# Altium project bdcmc-24-2-motors.PrjPcb
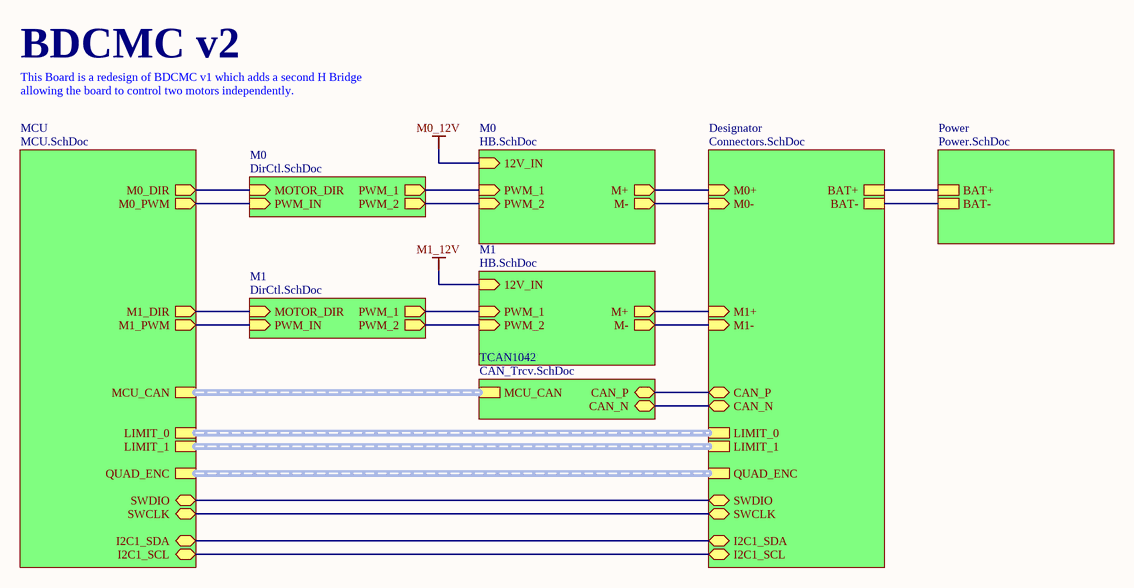
[diagram p0: TLD.SchDoc]
8 sheets, 198 parts. Net scope: hierarchical (ports join the sheet entries above them; power ports are global).
Board file: BDCMC_V2.PcbDoc
Sheets:
  TLD.SchDoc
    Designator = Connectors.SchDoc
    M0 = DirCtl.SchDoc
    M1 = DirCtl.SchDoc
    M0 = HB.SchDoc
    M1 = HB.SchDoc
    Power = Power.SchDoc
      M0 = Buck.SchDoc
      M1 = Buck.SchDoc
    TCAN1042 = CAN_Trcv.SchDoc
    MCU = MCU.SchDoc

## Sheet TLD.SchDoc
size Letter; SheetNumber: 1; SheetTotal: 8

### Sub-sheets
Designator = Connectors.SchDoc: M0+ (in), M0- (in), I2C1_SCL (bidir), M1+ (in), M1- (in), LIMIT_0 (harness LIMIT_0), LIMIT_1 (harness LIMIT_1), CAN_P (bidir), CAN_N (bidir), BAT-, BAT+, QUAD_ENC (harness QUAD_ENC), SWDIO (bidir), SWCLK (bidir), I2C1_SDA (bidir)
M0 = DirCtl.SchDoc: PWM_1 (out), PWM_2 (out), MOTOR_DIR (in), PWM_IN (in)
M0 = HB.SchDoc: M+ (out), M- (out), PWM_1 (in), PWM_2 (in), 12V_IN (in)
M1 = DirCtl.SchDoc: PWM_1 (out), PWM_2 (out), MOTOR_DIR (in), PWM_IN (in)
M1 = HB.SchDoc: M+ (out), M- (out), PWM_1 (in), PWM_2 (in), 12V_IN (in)
MCU = MCU.SchDoc: I2C1_SDA (bidir), I2C1_SCL (bidir), SWCLK (bidir), SWDIO (bidir), LIMIT_0 (harness LIMIT_0), LIMIT_1 (harness LIMIT_1), MCU_CAN (harness MCU_CAN), M1_PWM (out), M1_DIR (out), M0_PWM (out), M0_DIR (out), QUAD_ENC (harness QUAD_ENC)
Power = Power.SchDoc: BAT+, BAT-
TCAN1042 = CAN_Trcv.SchDoc: MCU_CAN (harness MCU_CAN), CAN_P (bidir), CAN_N (bidir)

### Nets
M0_12V: sheet M0/12V_IN, sheet M1/12V_IN  [also labelled M1_12V]  [project net BIAS]
Vin: sheet Designator/BAT+, sheet Power/BAT+
`: sheet M0/MOTOR_DIR, sheet MCU/M0_DIR
`: sheet M1/MOTOR_DIR, sheet MCU/M1_DIR  [a separate net that carries the same name]
CAN_N: sheet Designator/CAN_N, sheet TCAN1042/CAN_N
CAN_P: sheet Designator/CAN_P, sheet TCAN1042/CAN_P
DIR_1_In: sheet M0/PWM_1, sheet M0/PWM_1
DIR_1_In: sheet M1/PWM_1, sheet M1/PWM_1  [a separate net that carries the same name]
DIR_2_In: sheet M0/PWM_2, sheet M0/PWM_2
DIR_2_In: sheet M1/PWM_2, sheet M1/PWM_2  [a separate net that carries the same name]
I2C1_SCL: sheet Designator/I2C1_SCL, sheet MCU/I2C1_SCL
I2C1_SDA: sheet Designator/I2C1_SDA, sheet MCU/I2C1_SDA
M0_PWM: sheet M0/PWM_IN, sheet MCU/M0_PWM
M1_PWM: sheet M1/PWM_IN, sheet MCU/M1_PWM
M+: sheet Designator/M0+, sheet M0/M+
M+: sheet Designator/M1+, sheet M1/M+  [a separate net that carries the same name]
M-: sheet Designator/M0-, sheet M0/M-
M-: sheet Designator/M1-, sheet M1/M-  [a separate net that carries the same name]
SWCLK: sheet Designator/SWCLK, sheet MCU/SWCLK
SWDIO: sheet Designator/SWDIO, sheet MCU/SWDIO
NetQ200_2: sheet Designator/BAT-, sheet Power/BAT-

### Buses and harness runs
harness sheet Designator/LIMIT_0 = sheet MCU/LIMIT_0
harness sheet Designator/LIMIT_1 = sheet MCU/LIMIT_1
harness sheet Designator/QUAD_ENC = sheet MCU/QUAD_ENC
harness sheet MCU/MCU_CAN = sheet TCAN1042/MCU_CAN

### Notes on the sheet
- BDCMC v2
- This Board is a redesign of BDCMC v1 which adds a second H Bridge allowing the board to control two motors independently.

## Sheet Connectors.SchDoc
size Letter; SheetNumber: 2; SheetTotal: 8
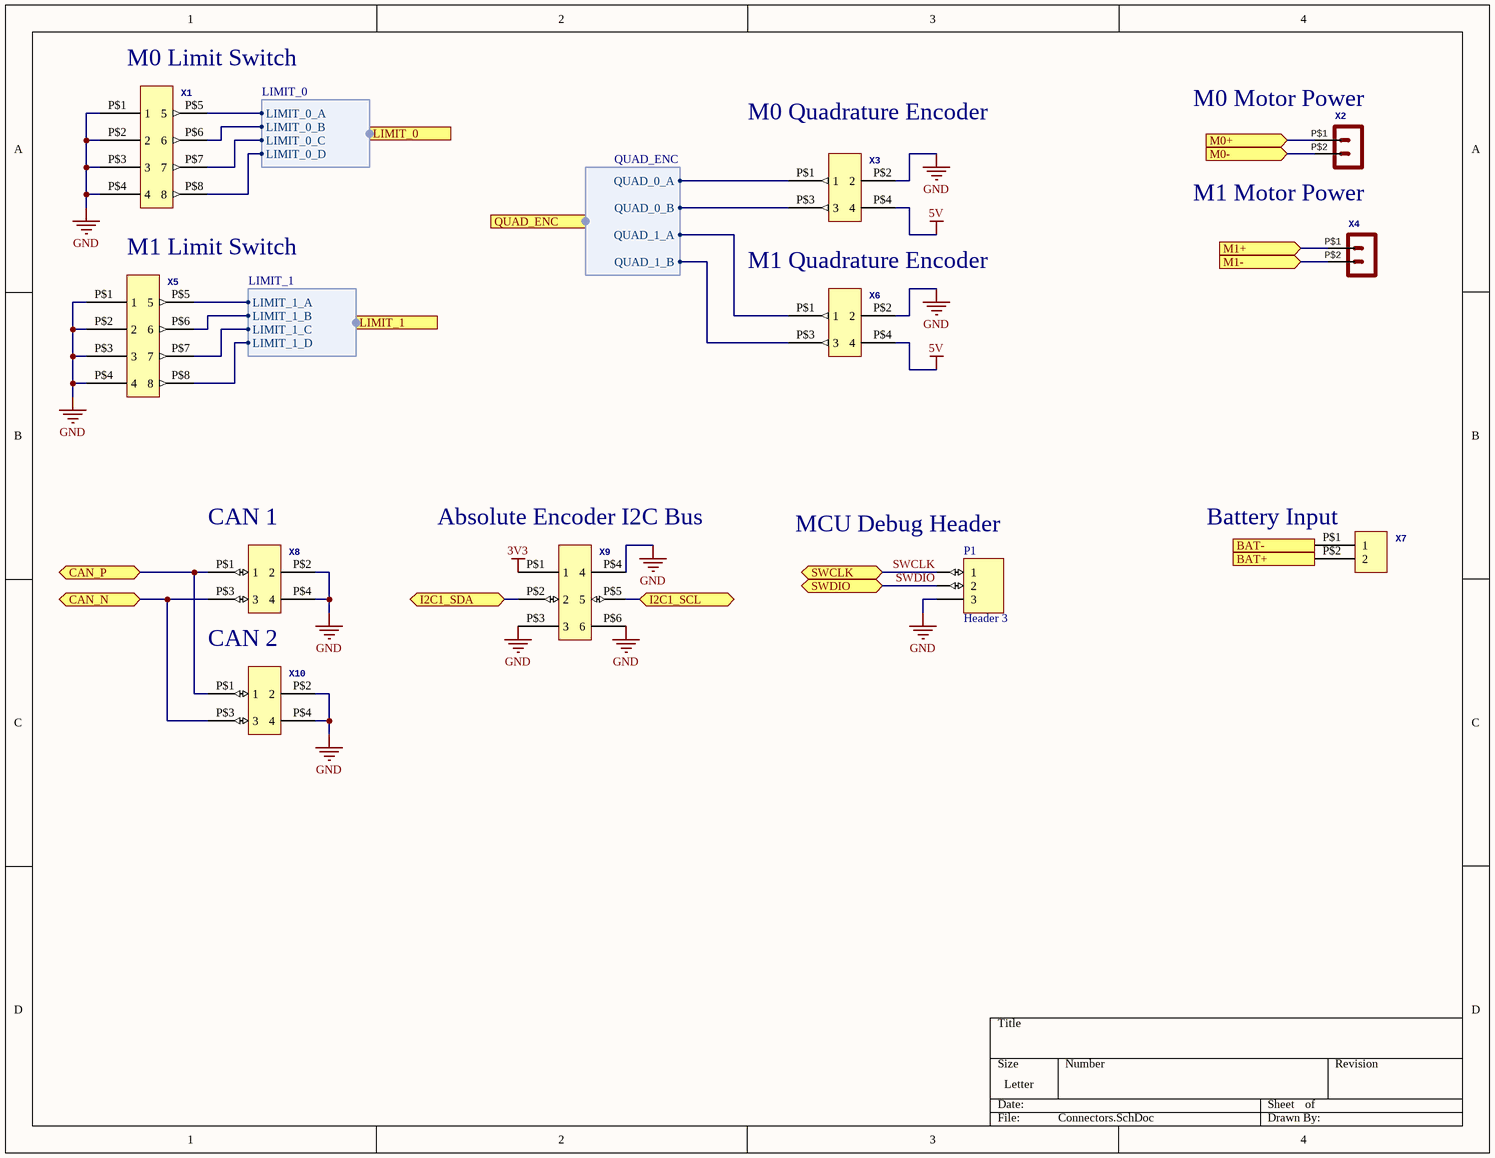
[diagram p1: Connectors.SchDoc]

### Parts
P1  Header 3  [HDR1X3]
X1  Molex 43045-0812  [43045-0812]  (value not drawn)
X2  Molex - Micro-Fit 3.0 Series connector,  3.00mm (0.118") pitch header, 2 positions.  [43045-0212]  (value not drawn)
X3  Molex 43045-0412  [43045-0412]  (value not drawn)
X4  Molex - Micro-Fit 3.0 Series connector,  3.00mm (0.118") pitch header, 2 positions.  [43045-0212]  (value not drawn)
X5  Molex 43045-0812  [43045-0812]  (value not drawn)
X6  Molex 43045-0412  [43045-0412]  (value not drawn)
X7  Molex 43650-0215  [43650-0215]  (value not drawn)
X8  Molex 43045-0412  [43045-0412]  (value not drawn)
X9  Molex 43045-0612  [43045-0612]  (value not drawn)
X10  Molex 43045-0412  [43045-0412]  (value not drawn)

### Ports
BAT+, BAT-, CAN_N (bidir), CAN_P (bidir), I2C1_SCL (bidir), I2C1_SDA (bidir), LIMIT_0 (harness LIMIT_0), LIMIT_1 (harness LIMIT_1), M0+ (in), M0- (in), M1+ (in), M1- (in), QUAD_ENC (harness QUAD_ENC), SWCLK (bidir), SWDIO (bidir)

### Harnesses
LIMIT_0: LIMIT_0_A, LIMIT_0_B, LIMIT_0_C, LIMIT_0_D
LIMIT_1: LIMIT_1_A, LIMIT_1_B, LIMIT_1_C, LIMIT_1_D
QUAD_ENC: QUAD_0_A, QUAD_1_A, QUAD_1_B, QUAD_0_B

### Nets
3V3: X9.P$1(1)  [project net MCU_VBAT]
5V: X3.P$4(4) X6.P$4(4)  [project net CAN_VCC]
GND: P1.3 X1.P$1(1) X1.P$2(2) X1.P$3(3) X1.P$4(4) X3.P$2(2) X5.P$1(1) X5.P$2(2) X5.P$3(3) X5.P$4(4) X6.P$2(2) X8.P$2(2) X8.P$4(4) X9.P$3(3) X9.P$4(4) X9.P$6(6) X10.P$2(2) X10.P$4(4)  [project net MCU_VSS]
Vin: X7.P$2(2) ; port BAT+
CAN_N: X8.P$3(3) X10.P$3(3) ; port CAN_N
CAN_P: X8.P$1(1) X10.P$1(1) ; port CAN_P
I2C1_SCL: X9.P$5(5) ; port I2C1_SCL
I2C1_SDA: X9.P$2(2) ; port I2C1_SDA
M+: X2.P$1 ; port M0+
M+: X4.P$1 ; port M1+  [a separate net that carries the same name]
M-: X2.P$2 ; port M0-
M-: X4.P$2 ; port M1-  [a separate net that carries the same name]
QUAD_0_A: X3.P$1(1) ; port QUAD_ENC.QUAD_0_A
QUAD_0_B: X3.P$3(3) ; port QUAD_ENC.QUAD_0_B
QUAD_1_A: X6.P$1(1) ; port QUAD_ENC.QUAD_1_A
QUAD_1_B: X6.P$3(3) ; port QUAD_ENC.QUAD_1_B
SWCLK: P1.1 ; port SWCLK
SWDIO: P1.2 ; port SWDIO
NetQ200_2: X7.P$1(1) ; port BAT-
NetU100_2: X1.P$5(5) ; port LIMIT_0.LIMIT_0_A
NetU100_3: X1.P$6(6) ; port LIMIT_0.LIMIT_0_B
NetU100_4: X1.P$7(7) ; port LIMIT_0.LIMIT_0_C
NetU100_5: X1.P$8(8) ; port LIMIT_0.LIMIT_0_D
NetU100_15: X5.P$5(5) ; port LIMIT_1.LIMIT_1_A
NetU100_16: X5.P$6(6) ; port LIMIT_1.LIMIT_1_B
NetU100_17: X5.P$7(7) ; port LIMIT_1.LIMIT_1_C
NetU100_18: X5.P$8(8) ; port LIMIT_1.LIMIT_1_D

### Notes on the sheet
- (near X1) M0 Limit Switch
- M0 Quadrature Encoder
- (near X2) M0 Motor Power
- M1 Motor Power
- M1 Limit Switch
- M1 Quadrature Encoder
- (near X8) CAN 1
- (near X9) Absolute Encoder I2C Bus
- (near P1) MCU Debug Header
- (near X7) Battery Input
- CAN 2

### Library data of the parts
P1 = Header 3: Header, 3-Pin; LatestRevisionDate: 17-Jul-2002; LatestRevisionNote: Re-released for DXP Platform.; Publisher: Altium Limited
X1 X5 = Micro-Fit Molex 8 Pin 2 Row Vertical: GateName_1: G$1; SymbolName_1: HEADER_POS8; DeviceSetName: HEADER_POS8_?; DeviceName: 43045-0812; LibraryName: con-molex-micro-fit-3_0_2; Package: 43045-0812
X2 X4 = HEADER_POS2_?43045-0212: GateName_1: G$1; SymbolName_1: HEADER_POS2; DeviceName: 43045-0212; LibraryName: con-molex-micro-fit-3_0_2; DeviceSetName: HEADER_POS2_?; Package: 43045-0212
X3 X6 X8 X10 = Micro-Fit Molex 4 Pin 2 Row Vertical: GateName_1: G$1; SymbolName_1: HEADER_POS4; DeviceSetName: HEADER_POS4_?; DeviceName: 43045-0412; LibraryName: con-molex-micro-fit-3_0_2; Package: 43045-0412
X7 = Micro-Fit Molex 2 Pin Vertical: SymbolName_1: HEADER_POS2; DeviceSetName: HEADER_POS2_?; GateName_1: G$1; Package: 43650-0215; DeviceName: 43650-0215; LibraryName: con-molex-micro-fit-3_0_2
X9 = Micro-Fit Molex 6 Pin 2 Row Vertical: GateName_1: G$1; SymbolName_1: HEADER_POS6; DeviceSetName: HEADER_POS6_?; DeviceName: 43045-0612; LibraryName: con-molex-micro-fit-3_0_2; Package: 43045-0612

## Sheet DirCtl.SchDoc
size Letter; SheetNumber: 3; SheetTotal: 8
Used 2 times, as channels M0, M1. Parts and nets are listed once, with the designators drawn on the sheet.
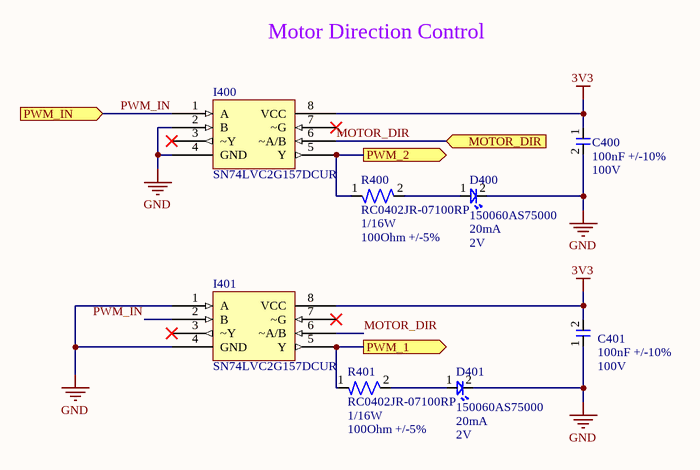
[diagram p2: DirCtl.SchDoc]

### Parts
C400  Capacitance: 100nF +/-10%  Voltage Rating: 100V  [CAP-0603]  (hidden comment: CC0603KRX7R0BB104)
C401  Capacitance: 100nF +/-10%  Voltage Rating: 100V  [CAP-0603]  (hidden comment: CC0603KRX7R0BB104)
D400  150060AS75000  Current Rating: 20mA  Vf: 2V  [LED-0603]
D401  150060AS75000  Current Rating: 20mA  Vf: 2V  [LED-0603]
I400  SN74LVC2G157DCUR  [IC-MUX-8VSSOP]
I401  SN74LVC2G157DCUR  [IC-MUX-8VSSOP]
R400  RC0402JR-07100RP  Power Rating: 1/16W  Resistance: 100Ohm +/-5%  [RES-0402]
R401  RC0402JR-07100RP  Power Rating: 1/16W  Resistance: 100Ohm +/-5%  [RES-0402]

### Ports
MOTOR_DIR (in), PWM_1 (out), PWM_2 (out), PWM_IN (in)

### Nets
3V3: C400.1 C401.2 I400.8(VCC) I401.8(VCC)
GND: C400.2 C401.1 D400.2 D401.2 I400.2(B) I400.4(GND) I401.1(A) I401.4(GND)
`: I400.6(~A/B) I401.6(~A/B) ; port MOTOR_DIR  [also labelled MOTOR_DIR]
PWM_1: I401.5(Y) R401.1 ; port PWM_1
PWM_2: I400.5(Y) R400.1 ; port PWM_2
PWM_IN: I400.1(A) I401.2(B) ; port PWM_IN
NetD400_1: D400.1 R400.2
NetD401_1: D401.1 R401.2

Not connected (* = marked no-connect by the designer): I400 3(~Y)* 7(~G)*; I401 3(~Y)* 7(~G)*

### Channels
M0: designators end in _M0; ports MOTOR_DIR=` PWM_1=DIR_1_In PWM_2=DIR_2_In PWM_IN=M0_PWM
M1: designators end in _M1; ports MOTOR_DIR=` PWM_1=DIR_1_In PWM_2=DIR_2_In PWM_IN=M1_PWM

### Notes on the sheet
- Motor Direction Control

### Library data of the parts
C400 C401 = CAP-100N-0001: CAP CER 0.1UF 100V X7R 0603; Manufacturer: YAGEO; Assembled?: no; Manufacturer Part Number: CC0603KRX7R0BB104; Temperature Coefficient: X7R; Package Size: 0603
D400 D401 = LED_Amber_0001: CAP CER 0.1UF 100V X7R 0603; Manufacturer: Wurth Electronik; Assembled?: no; Color: Amber; Manufacturer Part Number: 150060AS75000; Package Size: 0603
I400 = IC-MUX-0001
I401 = IC-MUX-0001: Multiplexer 1 x 2:1 8-VSSOP; Vin: 1.65-5.5V
R400 R401 = RES-100-0001: RES SMD 100 OHM 5% 1/16W 0402; Manufacturer: YAGEO; Assembled?: no; Manufacturer Part Number: RC0402JR-07100RP; Package Size: 0402

## Sheet HB.SchDoc
size Letter; SheetNumber: 6; SheetTotal: 8
Used 2 times, as channels M0, M1. Parts and nets are listed once, with the designators drawn on the sheet.
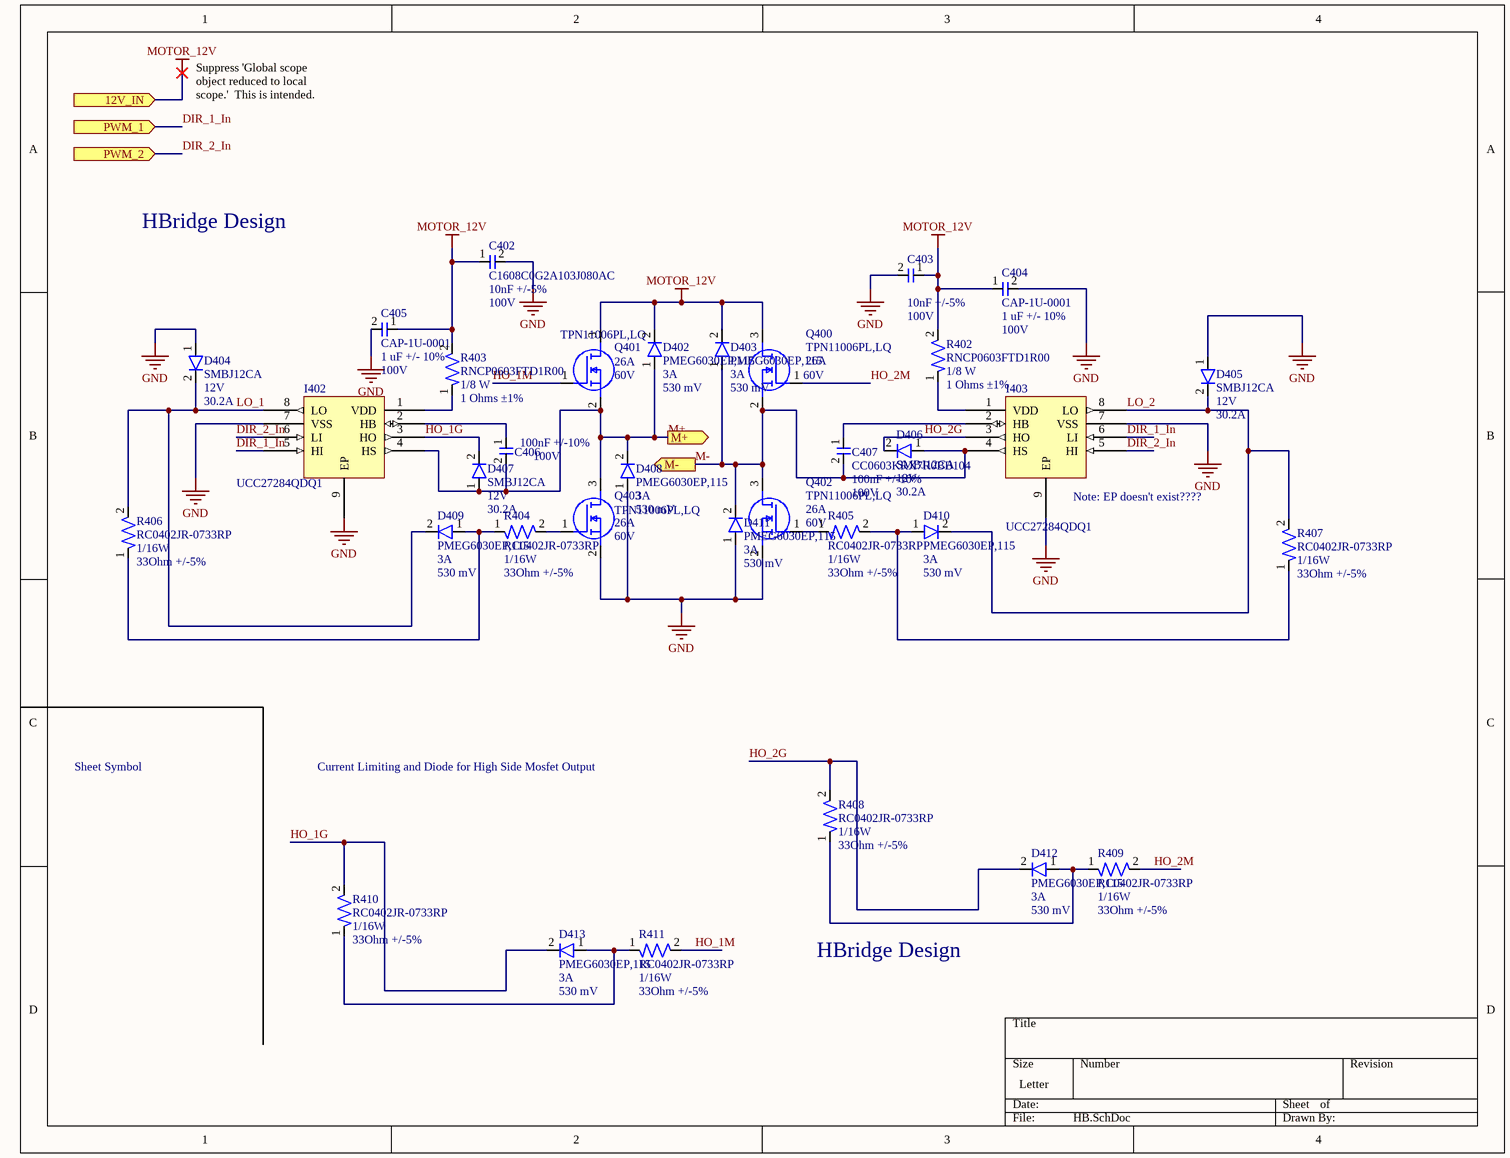
[diagram p3: HB.SchDoc]

### Parts
C402  C1608C0G2A103J080AC  Capacitance: 10nF +/-5%  Voltage Rating: 100V  [CAP-0603]
C403  Capacitance: 10nF +/-5%  Voltage Rating: 100V  [CAP-0603]  (hidden comment: C1608C0G2A103J080AC)
C404  CAP-1U-0001  Capacitance: 1 uF +/- 10%  Voltage: 100V  [CAP-1206 - duplicate]
C405  CAP-1U-0001  Capacitance: 1 uF +/- 10%  Voltage: 100V  [CAP-1206]
C406  Capacitance: 100nF +/-10%  Voltage Rating: 100V  [CAP-0603]  (hidden comment: CC0603KRX7R0BB104)
C407  CC0603KRX7R0BB104  Capacitance: 100nF +/-10%  Voltage Rating: 100V  [CAP-0603]
D402  PMEG6030EP,115  Current Rating: 3A  Vf (Voltage Forward): 530 mV  [DIO-SOD128]
D403  PMEG6030EP,115  Current Rating: 3A  Vf (Voltage Forward): 530 mV  [DIO-SOD128]
D404  SMBJ12CA  Standoff Voltage: 12V  Current Rating: 30.2A  [DO-214AA (SMBJ)]
D405  SMBJ12CA  Standoff Voltage: 12V  Current Rating: 30.2A  [DO-214AA (SMBJ)]
D406  SMBJ12CA  Standoff Voltage: 12V  Current Rating: 30.2A  [DO-214AA (SMBJ)]
D407  SMBJ12CA  Standoff Voltage: 12V  Current Rating: 30.2A  [DO-214AA (SMBJ)]
D408  PMEG6030EP,115  Current Rating: 3A  Vf (Voltage Forward): 530 mV  [DIO-SOD128]
D409  PMEG6030EP,115  Current Rating: 3A  Vf (Voltage Forward): 530 mV  [DIO-SOD128]
D410  PMEG6030EP,115  Current Rating: 3A  Vf (Voltage Forward): 530 mV  [DIO-SOD128]
D411  PMEG6030EP,115  Current Rating: 3A  Vf (Voltage Forward): 530 mV  [DIO-SOD128]
D412  PMEG6030EP,115  Current Rating: 3A  Vf (Voltage Forward): 530 mV  [DIO-SOD128]
D413  PMEG6030EP,115  Current Rating: 3A  Vf (Voltage Forward): 530 mV  [DIO-SOD128]
I402  UCC27284QDQ1  [IC-BUCK-8SOIC]
I403  UCC27284QDQ1  [IC-BUCK-8SOIC]
Q400  TPN11006PL,LQ  Id-Continuous: 26A  VDS-Max: 60V  [NMOS-8TSON]
Q401  TPN11006PL,LQ  Id-Continuous: 26A  VDS-Max: 60V  [NMOS-8TSON]
Q402  TPN11006PL,LQ  Id-Continuous: 26A  VDS-Max: 60V  [NMOS-8TSON]
Q403  TPN11006PL,LQ  Id-Continuous: 26A  VDS-Max: 60V  [NMOS-8TSON]
R402  RNCP0603FTD1R00  Power: 1/8 W  Resistance: 1 Ohms ±1%  [RES-0603]
R403  RNCP0603FTD1R00  Power: 1/8 W  Resistance: 1 Ohms ±1%  [RES-0603]
R404  RC0402JR-0733RP  Power Rating: 1/16W  Resistance: 33Ohm +/-5%  [RES-0402]
R405  RC0402JR-0733RP  Power Rating: 1/16W  Resistance: 33Ohm +/-5%  [RES-0402]
R406  RC0402JR-0733RP  Power Rating: 1/16W  Resistance: 33Ohm +/-5%  [RES-0402]
R407  RC0402JR-0733RP  Power Rating: 1/16W  Resistance: 33Ohm +/-5%  [RES-0402]
R408  RC0402JR-0733RP  Power Rating: 1/16W  Resistance: 33Ohm +/-5%  [RES-0402]
R409  RC0402JR-0733RP  Power Rating: 1/16W  Resistance: 33Ohm +/-5%  [RES-0402]
R410  RC0402JR-0733RP  Power Rating: 1/16W  Resistance: 33Ohm +/-5%  [RES-0402]
R411  RC0402JR-0733RP  Power Rating: 1/16W  Resistance: 33Ohm +/-5%  [RES-0402]

### Ports
12V_IN (in), M+ (out), M- (out), PWM_1 (in), PWM_2 (in)

### Nets
GND: C402.2 C403.2 C404.2 C405.2 D404.1 D405.1 D408.1 D411.1 I402.7(VSS) I402.9(EP) I403.7(VSS) I403.9(EP) Q402.2(S) Q403.2(S)
MOTOR_12V: C402.1 C403.1 C404.1 C405.1 D402.2 D403.2 Q400.3(D) Q401.3(D) R402.2 R403.2 ; port 12V_IN
DIR_1_In: I402.5(HI) I403.6(LI) ; port PWM_1
DIR_2_In: I402.6(LI) I403.5(HI) ; port PWM_2
HO_1G: D407.2 D413.2 I402.3(HO) R410.2
HO_1M: Q401.1(G) R411.2
HO_2G: D406.2 D412.2 I403.3(HO) R408.2
HO_2M: Q400.1(G) R409.2
LO_1: D404.2 D409.2 I402.8(LO) R406.2
LO_2: D405.2 D410.2 I403.8(LO) R407.2
M+: C406.2 D402.1 D407.1 D408.2 I402.4(HS) Q401.2(S) Q403.3(D) ; port M+
M-: C407.2 D403.1 D406.1 D411.2 I403.4(HS) Q400.2(S) Q402.3(D) ; port M-
NetC406_1: C406.1 I402.2(HB)
NetC407_1: C407.1 I403.2(HB)
NetD409_1: D409.1 R404.1 R406.1
NetD410_1: D410.1 R405.2 R407.1
NetD412_1: D412.1 R408.1 R409.1
NetD413_1: D413.1 R410.1 R411.1
NetI402_1: I402.1(VDD) R403.1
NetI403_1: I403.1(VDD) R402.1
NetQ402_1: Q402.1(G) R405.1
NetQ403_1: Q403.1(G) R404.2

### Channels
M0: designators end in _M0; ports 12V_IN=BIAS M+=M+ M-=M- PWM_1=DIR_1_In PWM_2=DIR_2_In
M1: designators end in _M1; ports 12V_IN=BIAS M+=M+ M-=M- PWM_1=DIR_1_In PWM_2=DIR_2_In

### Notes on the sheet
- Suppress 'Global scope object reduced to local scope.'  This is intended.
- HBridge Design
- (near I403) Note: EP doesn't exist????
- Sheet Symbol
- Current Limiting and Diode for High Side Mosfet Output

### Library data of the parts
C402 C403 = CAP-10N-0002: CAP CER 10000PF 100V C0G 0603; Manufacturer: TDK Corporation; Temperature Coefficient: C0G/NP0; Assembled?: no; Manufacturer Part Number: C1608C0G2A103J080AC; Package Size: 0603
C404 C405 = CAP-1U-0001: 1 µF ±10% 100V Ceramic Capacitor X7R 1206 (3216 Metric)
C406 C407 = CAP-100N-0001: as C400 on sheet DirCtl; Manufacturer Part Number: CC0603KRX7R0BB104; Temperature Coefficient: X7R; Package Size: 0603
D402 D403 D408-D413 = DIO-0.53V-0001: Diode Schottky 60 V 3A Surface Mount SOD-128/CFP5; Manufacturer: Nexperia USA Inc.; Assembled: no; Manufacturer Part Number: PMEG6030EP,115; Package: SOD-128/CFP5
D404-D407 = DIO-19.9V-0001: 19.9V Clamp 30.2A Ipp Tvs Diode Surface Mount DO-214AA (SMBJ); Manufacturer: Littlefuse Inc.; Assembled: No; Breakdown Voltage: 13.3; Manufacturer Part Number: SMBJ12CA; Package: DO-214AA (SMBJ)
I402 I403 = IC-GDRV-0001: Gate Drivers Automotive 3-A, 120-V half bridge gate driver with 5-V UVLO and enable 8-SOIC -40 to 125; Manufacturer: Texas Instruments; Assembled?: no; VCC-Max: 16V; VCC-Min: 5.5V; Load Voltage-Max: 120V; Supply Current: 3A; Manufacturer Part Number: UCC27284QDQ1; Package: SOIC-8
Q400-Q403 = NMOS-26A-0001: MOSFET N-CH 60V 200MA SOT23; Manufacturer: Toshiba; FET type: N-Channel; Rds On-Max: 18.1mOhm; Vgs-Max: 20V; Assembled?: no; Manufacturer Part Number: TPN11006PL,LQ; Package: 8-TSON Advance
R402 R403 = RES-1-0001: 1 Ohms ±1% 0.125W, 1/8W Chip Resistor 0603 (1608 Metric) Anti-Sulfur Thin Film
R404-R411 = RES-33-0001: RES SMD 33 OHM 5% 1/16W 0402; Manufacturer: YAGEO; Assembled?: no; Manufacturer Part Number: RC0402JR-0733RP; Package Size: 0402

## Sheet Power.SchDoc
size Letter; SheetNumber: 4; SheetTotal: 8
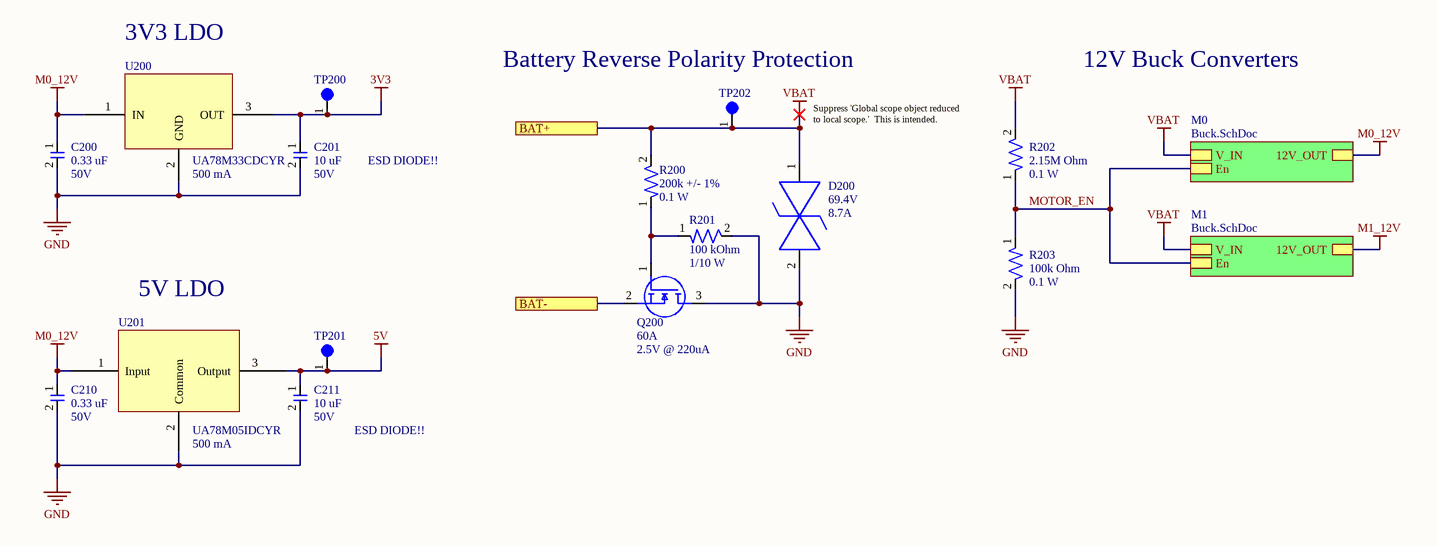
[diagram p4: Power.SchDoc]

### Parts
C200  Capacitance: 0.33 uF  Voltage: 50V  [CAP-0603]  (hidden comment: CGA3E3X7R1H334K080AB)
C201  Capacitance: 10 uF  Voltage Rating: 50V  [CAP-1206]  (hidden comment: CL31B106KBHNNNE)
C210  Capacitance: 0.33 uF  Voltage: 50V  [CAP-0603]  (hidden comment: CGA3E3X7R1H334K080AB)
C211  Capacitance: 10 uF  Voltage Rating: 50V  [CAP-1206]  (hidden comment: CL31B106KBHNNNE)
D200  Vclamp: 69.4V  Peak pulser current: 8.7A  [DO-214AA (SMBJ)]  (hidden comment: SMBJE43CAH)
Q200  Drain Current: 60A  Vgs: 2.5V @ 220uA  [NMOS-8PowerVDFN]  (hidden comment: TPH7R006PL,L1Q)
R200  Resistance: 200k +/- 1%  Power Rating: 0.1 W  [RES-0603]  (hidden comment: ERJ-3EKF2003V)
R201  Resistance: 100 kOhm  Power: 1/10 W  [RES-0603]  (hidden comment: RC0603FR-07100KL)
R202  Resistance: 2.15M Ohm  Power: 0.1 W  [RES-0603]  (hidden comment: RC0603FR-072M15L)
R203  Resistance: 100k Ohm  Power: 0.1 W  [RES-0603]  (hidden comment: RC0603FR-07100KL)
TP200  5003  [TEST-POINT-0001]  (value not drawn)
TP201  5003  [TEST-POINT-0001]  (value not drawn)
TP202  5003  [TEST-POINT-0001]  (value not drawn)
U200  UA78M33CDCYR  Current: 500 mA  [IC-SOT-223-4]
U201  UA78M05IDCYR  Current: 500 mA  [IC-SOT-223-4]

### Sub-sheets
M0 = Buck.SchDoc: En, 12V_OUT, V_IN
M1 = Buck.SchDoc: En, 12V_OUT, V_IN

### Ports
BAT+, BAT-

### Nets
3V3: C201.1 TP200.1 U200.3(OUT)  [project net MCU_VBAT]
5V: C211.1 TP201.1 U201.3(Output)  [project net CAN_VCC]
GND: C200.2 C201.2 C210.2 C211.2 D200.2 Q200.3(D) R201.2 R203.2 U200.2(GND) U201.2(Common)  [project net MCU_VSS]
M0_12V: C200.1 C210.1 U200.1(IN) U201.1(Input) ; sheet M0/12V_OUT, sheet M1/12V_OUT  [also labelled M1_12V]  [project net BIAS]
VBAT: D200.1 R200.2 R202.2 TP202.1 ; port BAT+, sheet M0/V_IN, sheet M1/V_IN  [project net Vin]
MOTOR_EN: R202.1 R203.1 ; sheet M0/En, sheet M1/En
NetQ200_1: Q200.1(G) R200.1 R201.1
NetQ200_2: Q200.2(S) ; port BAT-

### Notes on the sheet
- 3V3 LDO
- (near TP202) Battery Reverse Polarity Protection
- 12V Buck Converters
- Suppress 'Global scope object reduced to local scope.'  This is intended.
- ESD DIODE!!
- 5V LDO

### Library data of the parts
C200 C210 = CAP-0.33uF-0001: 0.33 µF ±10% 50V Ceramic Capacitor X7R 0603 (1608 Metric); Manufacturer: TDK Corporation; Manufacturer Part Number: CGA3E3X7R1H334K080AB; Tolerance: 10%; Temperature Coefficient: X7R
C201 C211 = CAP-10U-0001: 10 µF ±10% 50V Ceramic Capacitor X7R 1206 (3216 Metric); Manufacturer: Samsung Electro-Mechanics; Assembled?: no; Manufacturer Part Number: CL31B106KBHNNNE; Temperature Coefficient: X7R; Tolerance: 10%; Package Size: 1206
D200 = DIO-69.4V-0001: 69.4V Clamp 8.7A Ipp Tvs Diode Surface Mount DO-214AA (SMBJ); Channels: Bidirectional; Breakdown VOltage: 47.8V; Reverse working maximum voltage: 43V; Package: DO-214AA (SMBJ)
Q200 = NMOS-60A-0001: N-Channel 60 V 60A (Tc) 81W (Tc) Surface Mount 8-SOP Advance (5x5); Vdss: 60V; Vgs(Max): 20V; Package: 8-PowerVDFN
R200 = RES-200K-0001: 200 kOhms ±1% 0.1W, 1/10W Chip Resistor 0603 (1608 Metric) Automotive AEC-Q200 Thick Film; Manufacturer: Panasonic Electronic Components; Assembled?: Yes; MFP: ERJ-3EKF2003V; Package SIze: 0603
R201 = RES-100K-0003: 100 kOhms ±1% 0.1W, 1/10W Chip Resistor 0603 (1608 Metric) Moisture Resistant Thick Film; Tolerance: +/- 1%; Assembled?: No; Package Size: 0603
R202 = RES-2.15M-0001: 2.15 MOhms ±1% 0.1W, 1/10W Chip Resistor 0603 (1608 Metric) Moisture Resistant Thick Film; Assembled?: No; Tolerance: 1%; Package Size: 0603
R203 = RES-100K-0003: 100 kOhms ±1% 0.1W, 1/10W Chip Resistor 0603 (1608 Metric) Moisture Resistant Thick Film; Assembled?: No; Tolerance: 1%; Package Size: 0603
TP200-TP202 = TEST-POINT-0001: Oranange PC Test Point, Miniature Phoisphor Bronze Silver Plating Through Hole Mounting Type
U200 = IC-LDO-3.3V-0002: Linear Voltage Regulator IC Positive Fixed 1 Output 500mA SOT-223-4; Vin: 25V; Vout: 3.3V; Package: SOT-223-4
U201 = IC-LDO-5V-0003: Linear Voltage Regulator IC Positive Fixed 1 Output 500mA SOT-223-4; Manufacturer: Texas Instruments; Assembled?: no; Manufacturer Part Number: UA78M05IDCYR; Package Size: SOT223-4; Type: Low dropout (LDO)

## Sheet Buck.SchDoc
size Letter; SheetNumber: 5; SheetTotal: 8
Used 2 times, as channels Power/M0, Power/M1. Parts and nets are listed once, with the designators drawn on the sheet.
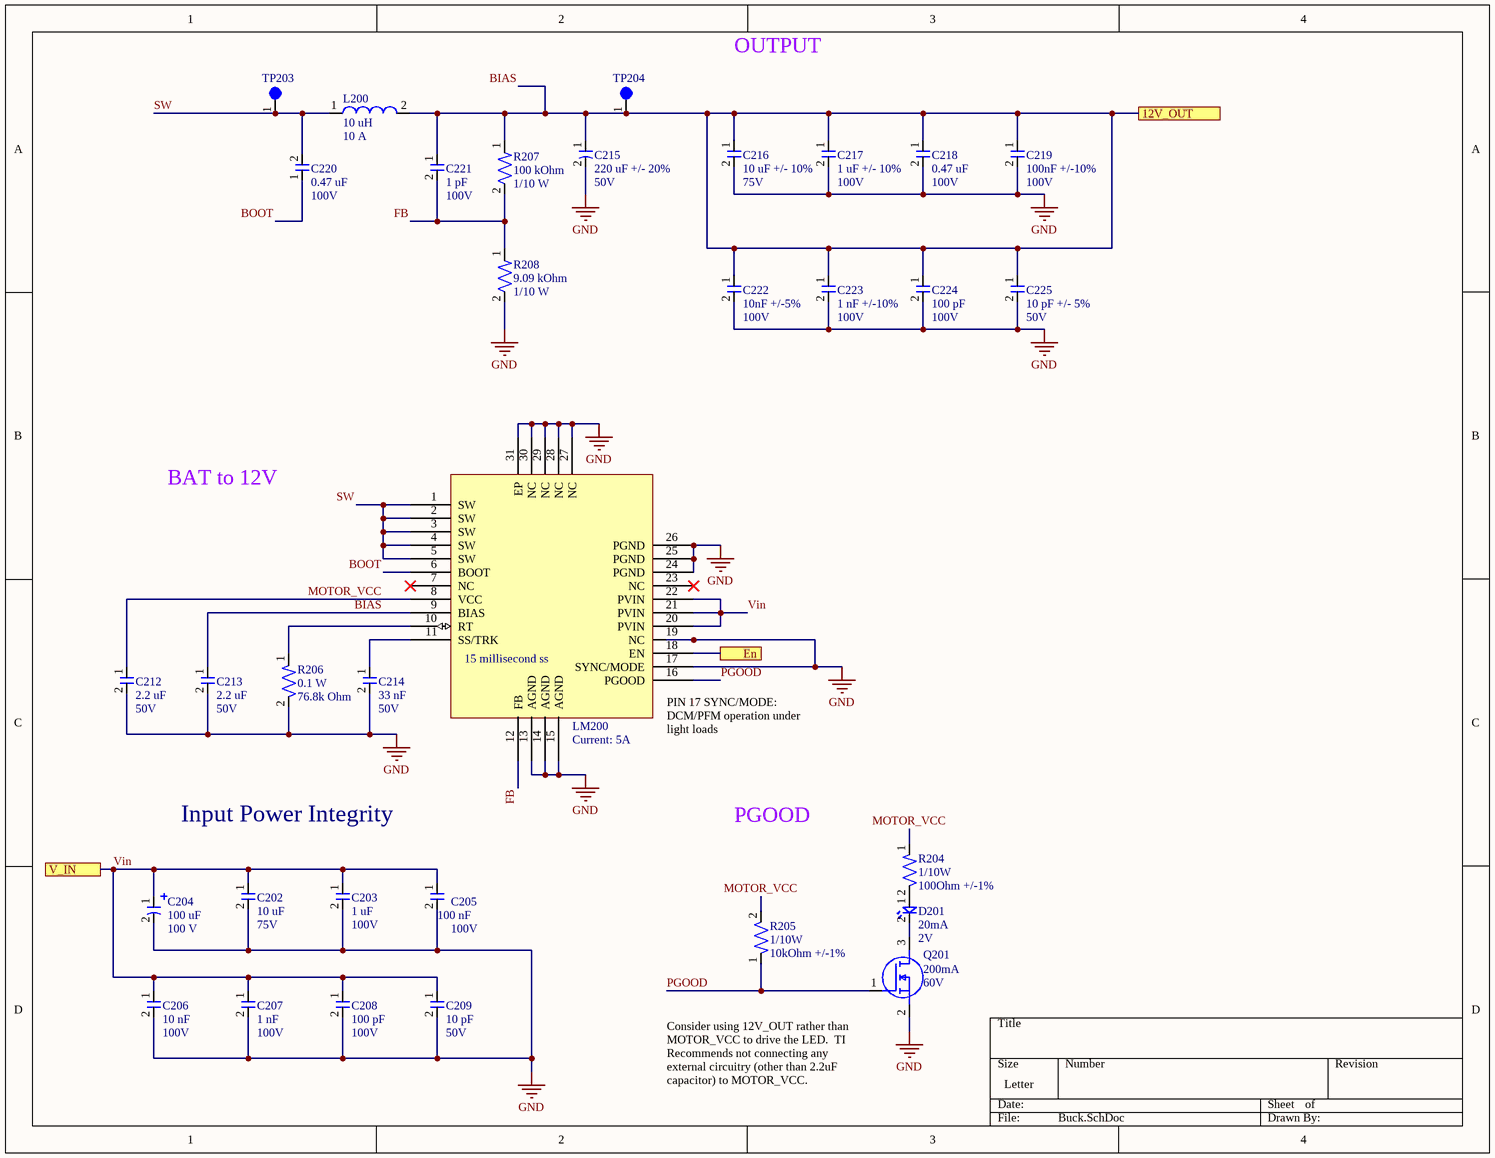
[diagram p5: Buck.SchDoc]

### Parts
C202  Capacitance: 10 uF  Voltage Rating: 75V  [CAP-1210]  (hidden comment: C3225X7R1N106K250AC)
C203  Capacitance: 1 uF  Voltage: 100V  [CAP-1206]  (hidden comment: CL31B105KCHNNNE)
C204  Capacitance: 100 uF  Voltage: 100 V  [ELEC-100U-0001]  (hidden comment: 100SEV100M12.5X16)
C205  Capacitance: 100 nF  Voltage Rating: 100V  [CAP-0603]  (hidden comment: CC0603KRX7R0BB104)
C206  Capacitance: 10 nF  Voltage Rating: 100V  [CAP-0603]  (hidden comment: C1608C0G2A103J080AC)
C207  Capacitance: 1 nF  Voltage: 100V  [CAP-0603]  (hidden comment: C0603Y102K1RAC7867)
C208  Capacitance: 100 pF  Voltage: 100V  [CAP-0603]  (hidden comment: 0603N101J101CT)
C209  Capacitance: 10 pF  Voltage Rating: 50V  [CAP-0603]  (hidden comment: 0603N100J500CT)
C212  Capacitance: 2.2 uF  oltage: 50V  [CAP-0603]  (hidden comment: UMK107BBJ225KA-T)
C213  Capacitance: 2.2 uF  oltage: 50V  [CAP-0603]  (hidden comment: UMK107BBJ225KA-T)
C214  Capacitance: 33 nF  Voltage Rating: 50V  [CAP-0603]  (hidden comment: CC0603KRX7R9BB333)
C215  Capacitance: 220 uF +/- 20%  Voltage Rating: 50V  [ELEC-220U-0003]  (hidden comment: 50TZV220M10X10.5)
C216  Capacitance: 10 uF +/- 10%  Voltage Rating: 75V  [CAP-1210]  (hidden comment: C3225X7R1N106K250AC)
C217  Capacitance: 1 uF +/- 10%  Voltage: 100V  [CAP-1206]  (hidden comment: CL31B105KCHNNNE)
C218  Capacitance: 0.47 uF  Voltage: 100V  [CAP-0805]  (hidden comment: KAM21KR72A474KL)
C219  Capacitance: 100nF +/-10%  Voltage Rating: 100V  [CAP-0603]  (hidden comment: CC0603KRX7R0BB104)
C220  Capacitance: 0.47 uF  Voltage: 100V  [CAP-0805]  (hidden comment: KAM21KR72A474KL)
C221  Capacitance: 1 pF  Voltage: 100V  [CAP-0603]  (hidden comment: 885012006087)
C222  Capacitance: 10nF +/-5%  Voltage Rating: 100V  [CAP-0603]  (hidden comment: C1608C0G2A103J080AC)
C223  Capacitance: 1 nF +/-10%  Voltage: 100V  [CAP-0603]  (hidden comment: C0603Y102K1RAC7867)
C224  Capacitance: 100 pF  Voltage: 100V  [CAP-0603]  (hidden comment: 0603N101J101CT)
C225  Capacitance: 10 pF +/- 5%  Voltage Rating: 50V  [CAP-0603]  (hidden comment: 0603N100J500CT)
D201  Current Rating: 20mA  Vf: 2V  [LED-0603]  (hidden comment: 150060AS75000)
L200  Inductance: 10 uH  DCI: 10 A  [PWRIND-10U-0002]  (hidden comment: SRP1270-100M)
LM200  Current: 5A  [IC-30-WQFN(6x4)]  (hidden comment: LM76005RNPR)
Q201  Id-Continuous: 200mA  VDS-Max: 60V  [NMOS-SOT23-3]  (hidden comment: T2N7002AK,LM)
R204  Power Rating: 1/10W  Resistance: 100Ohm +/-1%  [RES-0603]  (hidden comment: AC0603FR-10100RL)
R205  Power Rating: 1/10W  Resistance: 10kOhm +/-1%  [RES-0603]  (hidden comment: RC0603FR-0710KP)
R206  Power: 0.1 W  Resistance: 76.8k Ohm  [RES-0603]  (hidden comment: RC0603FR-0776K8L)
R207  Resistance: 100 kOhm  Power: 1/10 W  [RES-0603]  (hidden comment: RC0603FR-07100KL)
R208  Resistance: 9.09 kOhm  Power: 1/10 W  [RES-0603]  (hidden comment: RC0603FR-079K09L)
TP203  5003  [TEST-POINT-0001]  (value not drawn)
TP204  5003  [TEST-POINT-0001]  (value not drawn)

### Ports
12V_OUT, En, V_IN

### Nets
GND: C202.2 C203.2 C204.2 C205.2 C206.2 C207.2 C208.2 C209.2 C212.2 C213.2 C214.2 C215.2 C216.2 C217.2 C218.2 C219.2 C222.2 C223.2 C224.2 C225.2 LM200.13(AGND) LM200.14(AGND) LM200.15(AGND) LM200.17(SYNC/MODE) LM200.19(NC) LM200.24(PGND) LM200.25(PGND) LM200.26(PGND) LM200.27(NC) LM200.28(NC) LM200.29(NC) LM200.30(NC) LM200.31(EP) Q201.2(S) R206.2 R208.2
BIAS: C213.1 C215.1 C216.1 C217.1 C218.1 C219.1 C221.1 C222.1 C223.1 C224.1 C225.1 L200.2 LM200.9(BIAS) R207.1 TP204.1 ; port 12V_OUT
BOOT: C220.1 LM200.6(BOOT)
En: LM200.18(EN) ; port En
FB: C221.2 LM200.12(FB) R207.2 R208.1
MOTOR_VCC: C212.1 LM200.8(VCC) R204.1 R205.2
PGOOD: LM200.16(PGOOD) Q201.1(G) R205.1
SW: C220.2 L200.1 LM200.1(SW) LM200.2(SW) LM200.3(SW) LM200.4(SW) LM200.5(SW) TP203.1
Vin: C202.1 C203.1 C204.1 C205.1 C206.1 C207.1 C208.1 C209.1 LM200.20(PVIN) LM200.21(PVIN) LM200.22(PVIN) ; port V_IN
NetC214_1: C214.1 LM200.11(SS/TRK)
NetD201_1: D201.1 R204.2
NetD201_2: D201.2 Q201.3(D)
NetLM200_10: LM200.10(RT) R206.1

Not connected (* = marked no-connect by the designer): LM200 7(NC)* 23(NC)*

### Channels
Power/M0: designators end in _M0; ports 12V_OUT=BIAS En=MOTOR_EN V_IN=Vin
Power/M1: designators end in _M1; ports 12V_OUT=BIAS En=MOTOR_EN V_IN=Vin

### Notes on the sheet
- OUTPUT
- BAT to 12V
- (near LM200) 15 millisecond ss
- (near LM200) PIN 17 SYNC/MODE: DCM/PFM operation under light loads
- Input Power Integrity
- PGOOD
- (near Q201) Consider using 12V_OUT rather than MOTOR_VCC to drive the LED.  TI Recommends not connecting any external circuitry (other than 2.2uF capacitor) to MOTOR_VCC.

### Library data of the parts
C202 C216 = CAP-10U-0004: 10 µF ±10% 75V Ceramic Capacitor X7R 1210 (3225 Metric)
  C202: Tolerance: 10%
C203 C217 = CAP-1U-0001: as C404 on sheet HB
  C203: Tolerance: 10%
C204 = ELEC-100U-0001: 100 µF 100 V Aluminum Electrolytic Capacitors Radial, Can - SMD 2000 Hrs @ 85°C; Manufacturer: Rubycon; Tolerance: 20%; Assembled?: No; ESR: idk check the datasheet i couldnt find it
C205 = CAP-100N-0001: CAP CER 0.1UF 100V X7R 0603; Manufacturer: YAGEO; Assembled?: no; Tolerance: 10%; Manufacturer Part Number: CC0603KRX7R0BB104; Temperature Coefficient: X7R; Package Size: 0603
C206 = CAP-10N-0002: CAP CER 10000PF 100V C0G 0603; Manufacturer: TDK Corporation; Temperature Coefficient: C0G/NP0; Assembled?: no; Tolerance: 5%; Manufacturer Part Number: C1608C0G2A103J080AC; Package Size: 0603
C207 C223 = CAP-1N-0001: 1000 pF ±10% 100V Ceramic Capacitor X7R 0603 (1608 Metric)
  C207: Tolerance: 10%
C208 = CAP-100P-0002: 100 pF ±5% 100V Ceramic Capacitor C0G, NP0 0603 (1608 Metric); Temp Coeff: C0G/NP0; Tolerance: 5%; Package Size: 0603
C209 C225 = CAP-10P-0001: 10 pF ±5% 50V Ceramic Capacitor C0G, NP0 0603 (1608 Metric); Manufacturer: Walshin Technology Corporation; Assembled?: Yes; Manufacturer Part Number: 0603N100J500CT; Temperature Coefficient: C0G, NP0; Package Size: 0603
  C209: Tolerance: 5%
C212 C213 = CAP-2.2U-0001: 2.2 µF ±10% 50V Ceramic Capacitor X5R 0603 (1608 Metric); Tolerance: 10%
C214 = CAP-33N-0001: 0.033 µF ±10% 50V Ceramic Capacitor X7R 0603 (1608 Metric); Manufacturer: YAGEO; Assembled?: no; Manufacturer Part Number: CC0603KRX7R9BB333; Temperature Coefficient: X7R; Package Size: 0603; Tolerance: 10%
C215 = ELEC-220U-0003: 220 µF 50 V Aluminum Electrolytic Capacitors Radial, Can - SMD 2000 Hrs @ 105°C; Size: .406inx.406in*.413in
C218 C220 = CAP-0.47U-0001: 0.47 µF ±10% 100V Ceramic Capacitor X7R 0805 (2012 Metric); Tolerance: +/- 10%; Assembled?: No; Temperature Coefficient: X7R; Package Size: 0805
C219 = CAP-100N-0001: as C400 on sheet DirCtl; Manufacturer Part Number: CC0603KRX7R0BB104; Temperature Coefficient: X7R; Package Size: 0603
C221 = CAP-1P-0001: 1 pF ±0.25pF 100V Ceramic Capacitor C0G, NP0 0603 (1608 Metric); Tolerance: +/- 0.25 pF; Temperature Coefficient: C0G/NP0; Assembled?: No; Package Size: 0603
C222 = CAP-10N-0002: as C402 on sheet HB; Manufacturer Part Number: C1608C0G2A103J080AC; Package Size: 0603
C224 = CAP-100P-0002: 100 pF ±5% 100V Ceramic Capacitor C0G, NP0 0603 (1608 Metric); Tolerance: +/-5%; Temp Coeff: C0G/NP0; Package Size: 0603
D201 = LED_Amber_0001: Amber LED 0603; Manufacturer: Wurth Electronik; Assembled?: no; Manufacturer Part Number: 150060AS75000; Package Size: 0603; Color: Amber
L200 = PWRIND-10U-0002: 10 µH Shielded Drum Core, Wirewound Inductor 10 A 16.8mOhm Max Nonstandard; Tolerance: +/- 20%; Isat: 16A; Assembled?: No; DCR: 16.8 mOhm
LM200 = IC-BUCK-0006: Buck Switching Regulator IC Positive Adjustable 1V 1 Output 5A 30-WFQFN Exposed Pad; Manufacturer: Texas Instruments; Assembled?: no; Manufacturer Part Number: LM76005RNPR; Type: Buck; Package: 30-WFQFN
Q201 = NMOS-200MA-0001: MOSFET N-CH 60V 200MA SOT23; Manufacturer: Toshiba; FET type: N-Channel; Rds On-Max: 3.9Ohm; Vgs-Max: 20V; Assembled?: no; Manufacturer Part Number: T2N7002AK,LM; Package: SOT-23-3
R204 = RES-100-0002: 100 Ohms ±1% 0.1W, 1/10W Chip Resistor 0603 (1608 Metric) Automotive AEC-Q200 Thick Film; Manufacturer: YAGEO; Assembled?: no; Manufacturer Part Number: AC0603FR-10100RL; Package Size: 0603
R205 = RES-10K-0002: RES SMD 10K OHM 1% 1/10W 0603; Manufacturer: YAGEO; Assembled?: no; Manufacturer Part Number: RC0603FR-0710KP; Package Size: 0603
R206 = RES-76.8K-0001: 76.8 kOhms ±1% 0.1W, 1/10W Chip Resistor 0603 (1608 Metric) Moisture Resistant Thick Film; Manufacturer: Yageo; Package Size: 0603; Tolerance: 1%
R207 = RES-100K-0003: as R201 on sheet Power; Package Size: 0603
R208 = RES-9.09K-0001: 9.09 kOhms ±1% 0.1W, 1/10W Chip Resistor 0603 (1608 Metric) Moisture Resistant Thick Film; Tolerance: +/-1%; Assembled?: No; Package Size: 0603
TP203 TP204 = TEST-POINT-0001: as TP200 on sheet Power

## Sheet CAN_Trcv.SchDoc
size Letter; SheetNumber: 7; SheetTotal: 8
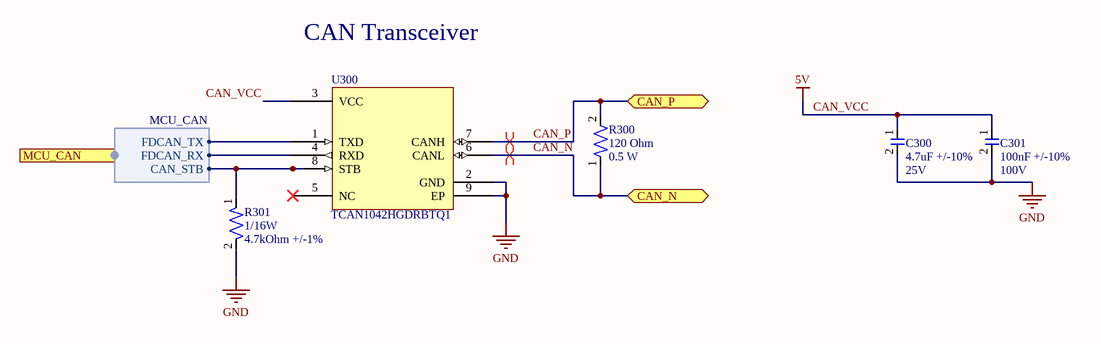
[diagram p6: CAN_Trcv.SchDoc]

### Parts
C300  Capacitance: 4.7uF +/-10%  Voltage Rating: 25V  [CAP-0603]  (hidden comment: TMK107BBJ475KA-T)
C301  Capacitance: 100nF +/-10%  Voltage Rating: 100V  [CAP-0603]  (hidden comment: CC0603KRX7R0BB104)
R300  Resistance: 120 Ohm  Power: 0.5 W  [RES-1206]  (hidden comment: CRGH1206F120R)
R301  Power Rating: 1/16W  Resistance: 4.7kOhm +/-1%  [RES-0402]  (hidden comment: RC0402FR-074K7P)
U300  TCAN1042HGDRBTQ1  [IC-8-VSON]

### Ports
CAN_N (bidir), CAN_P (bidir), MCU_CAN (harness MCU_CAN)

### Harnesses
MCU_CAN: FDCAN_TX, FDCAN_RX, CAN_STB

### Nets
CAN_VCC: C300.1 C301.1 U300.3(VCC)  [also labelled 5V]
GND: C300.2 C301.2 R301.2 U300.2(GND) U300.9(EP)  [project net MCU_VSS]
CAN_N: R300.1 U300.6(CANL) ; port CAN_N
CAN_P: R300.2 U300.7(CANH) ; port CAN_P
CAN_STB: R301.1 U300.8(STB) ; port MCU_CAN.CAN_STB
FDCAN_RX: U300.4(RXD) ; port MCU_CAN.FDCAN_RX
FDCAN_TX: U300.1(TXD) ; port MCU_CAN.FDCAN_TX

Not connected (* = marked no-connect by the designer): U300 5(NC)*

### Layout directives
differential pair: CAN_N, CAN_P

### Notes on the sheet
- CAN Transceiver

### Library data of the parts
C300 = CAP-4.7U-0001: 4.7 µF ±10% 25V Ceramic Capacitor X5R 0603 (1608 Metric); Manufacturer: Taiyo Yuden; Assembled?: no; Manufacturer Part Number: TMK107BBJ475KA-T; Temperature Coefficient: X5R; Package Size: 0603
C301 = CAP-100N-0001: as C400 on sheet DirCtl; Manufacturer Part Number: CC0603KRX7R0BB104; Temperature Coefficient: X7R; Package Size: 0603
R300 = RES-120-0002: 120 Ohms ±1% 0.5W, 1/2W Chip Resistor 1206 (3216 Metric) Thick Film; Tolerance: 1%; Package Size: 1206
R301 = RES-4.7K-0001: RES SMD 4.7K OHM 1% 1/16W 0402; Manufacturer: YAGEO; Assembled?: no; Manufacturer Part Number: RC0402FR-074K7P; Package Size: 0402
U300 = IC-CAN-TRANSCEIVER-0002: 1/1 Transceiver CANbus 8-VSON (3x3); Manufacturer: Texas Instrument; CAN Capability: FD-CAN; Manufacturer Part Number: TCAN1042HGDRBTQ1

## Sheet MCU.SchDoc
size Letter; SheetNumber: 8; SheetTotal: 8
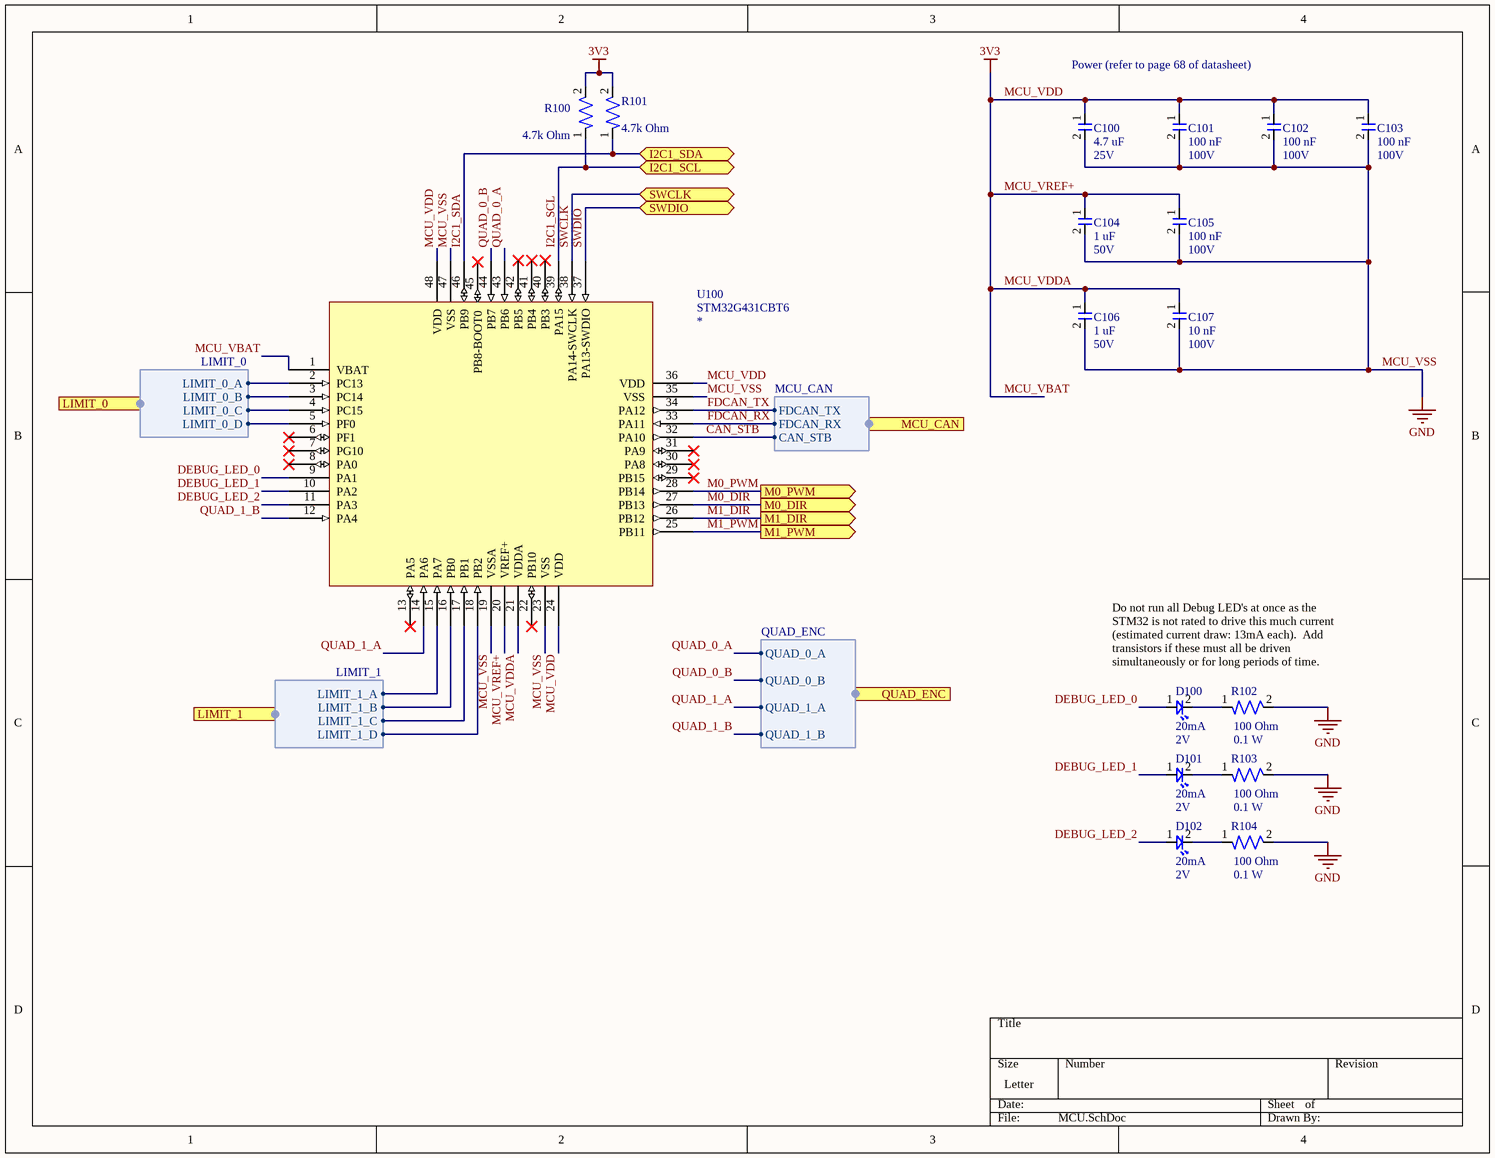
[diagram p7: MCU.SchDoc]

### Parts
C100  Capacitance: 4.7 uF  Voltage Rating: 25V  [CAP-0603]  (hidden comment: TMK107BBJ475KA-T)
C101  Capacitance: 100 nF  Voltage Rating: 100V  [CAP-0603]  (hidden comment: CC0603KRX7R0BB104)
C102  Capacitance: 100 nF  Voltage Rating: 100V  [CAP-0603]  (hidden comment: CC0603KRX7R0BB104)
C103  Capacitance: 100 nF  Voltage Rating: 100V  [CAP-0603]  (hidden comment: CC0603KRX7R0BB104)
C104  Capacitance: 1 uF  Voltage: 50V  [CAP-0603]  (hidden comment: UMK107AB7105KA-T)
C105  Capacitance: 100 nF  Voltage Rating: 100V  [CAP-0603]  (hidden comment: CC0603KRX7R0BB104)
C106  Capacitance: 1 uF  Voltage: 50V  [CAP-0603]  (hidden comment: UMK107AB7105KA-T)
C107  Capacitance: 10 nF  Voltage Rating: 100V  [CAP-0402]  (hidden comment: CC0402KRX7R0BB103)
D100  Current Rating: 20mA  Vf: 2V  [LED-0603]  (hidden comment: 150060AS75000)
D101  Current Rating: 20mA  Vf: 2V  [LED-0603]  (hidden comment: 150060AS75000)
D102  Current Rating: 20mA  Vf: 2V  [LED-0603]  (hidden comment: 150060AS75000)
R100  Resistance: 4.7k Ohm  [RES-0603]  (hidden comment: AF0603FR-074K7L)
R101  Resistance: 4.7k Ohm  [RES-0603]  (hidden comment: AF0603FR-074K7L)
R102  Resistance: 100 Ohm  Power: 0.1 W  [RES-0603]  (hidden comment: AC0603FR-10100RL)
R103  Resistance: 100 Ohm  Power: 0.1 W  [RES-0603]  (hidden comment: AC0603FR-10100RL)
R104  Resistance: 100 Ohm  Power: 0.1 W  [RES-0603]  (hidden comment: AC0603FR-10100RL)
U100  STM32G431CBT6  [Quad48]

### Ports
I2C1_SCL (bidir), I2C1_SDA (bidir), LIMIT_0 (harness LIMIT_0), LIMIT_1 (harness LIMIT_1), M0_DIR (out), M0_PWM (out), M1_DIR (out), M1_PWM (out), MCU_CAN (harness MCU_CAN), QUAD_ENC (harness QUAD_ENC), SWCLK (bidir), SWDIO (bidir)

### Harnesses
LIMIT_0: LIMIT_0_A, LIMIT_0_B, LIMIT_0_C, LIMIT_0_D
LIMIT_1: LIMIT_1_A, LIMIT_1_B, LIMIT_1_C, LIMIT_1_D
MCU_CAN: FDCAN_TX, FDCAN_RX, CAN_STB
QUAD_ENC: QUAD_0_A, QUAD_1_A, QUAD_1_B, QUAD_0_B

### Nets
MCU_VBAT: C100.1 C101.1 C102.1 C103.1 C104.1 C105.1 C106.1 C107.1 R100.2 R101.2 U100.1(VBAT) U100.20(VREF+) U100.21(VDDA) U100.24(VDD) U100.36(VDD) U100.48(VDD)  [also labelled 3V3, MCU_VDD, MCU_VDDA, MCU_VREF+]
MCU_VSS: C100.2 C101.2 C102.2 C103.2 C104.2 C105.2 C106.2 C107.2 R102.2 R103.2 R104.2 U100.19(VSSA) U100.23(VSS) U100.35(VSS) U100.47(VSS)  [also labelled GND]
CAN_STB: U100.32(PA10) ; port MCU_CAN.CAN_STB
DEBUG_LED_0: D100.1 U100.9(PA1)
DEBUG_LED_1: D101.1 U100.10(PA2)
DEBUG_LED_2: D102.1 U100.11(PA3)
FDCAN_RX: U100.33(PA11) ; port MCU_CAN.FDCAN_RX
FDCAN_TX: U100.34(PA12) ; port MCU_CAN.FDCAN_TX
I2C1_SCL: R100.1 U100.39(PA15) ; port I2C1_SCL
I2C1_SDA: R101.1 U100.46(PB9) ; port I2C1_SDA
M0_DIR: U100.27(PB13) ; port M0_DIR  [project net `]
M0_PWM: U100.28(PB14) ; port M0_PWM
M1_DIR: U100.26(PB12) ; port M1_DIR  [project net `]
M1_PWM: U100.25(PB11) ; port M1_PWM
QUAD_0_A: U100.43(PB6) ; port QUAD_ENC.QUAD_0_A
QUAD_0_B: U100.44(PB7) ; port QUAD_ENC.QUAD_0_B
QUAD_1_A: U100.14(PA6) ; port QUAD_ENC.QUAD_1_A
QUAD_1_B: U100.12(PA4) ; port QUAD_ENC.QUAD_1_B
SWCLK: U100.38(PA14-SWCLK) ; port SWCLK
SWDIO: U100.37(PA13-SWDIO) ; port SWDIO
NetD100_2: D100.2 R102.1
NetD101_2: D101.2 R103.1
NetD102_2: D102.2 R104.1
NetU100_2: U100.2(PC13) ; port LIMIT_0.LIMIT_0_A
NetU100_3: U100.3(PC14) ; port LIMIT_0.LIMIT_0_B
NetU100_4: U100.4(PC15) ; port LIMIT_0.LIMIT_0_C
NetU100_5: U100.5(PF0) ; port LIMIT_0.LIMIT_0_D
NetU100_15: U100.15(PA7) ; port LIMIT_1.LIMIT_1_A
NetU100_16: U100.16(PB0) ; port LIMIT_1.LIMIT_1_B
NetU100_17: U100.17(PB1) ; port LIMIT_1.LIMIT_1_C
NetU100_18: U100.18(PB2) ; port LIMIT_1.LIMIT_1_D

Not connected (* = marked no-connect by the designer): U100 6(PF1)* 7(PG10)* 8(PA0)* 13(PA5)* 22(PB10)* 29(PB15)* 30(PA8)* 31(PA9)* 40(PB3)* 41(PB4)* 42(PB5)* 45(PB8-BOOT0)*

### Notes on the sheet
- Power (refer to page 68 of datasheet)
- Do not run all Debug LED's at once as the STM32 is not rated to drive this much current (estimated current draw: 13mA each).  Add transistors if these must all be driven simultaneously or for long periods of time.

### Library data of the parts
C100 = CAP-4.7U-0001: as C300 on sheet CAN_Trcv; Manufacturer Part Number: TMK107BBJ475KA-T; Temperature Coefficient: X5R; Package Size: 0603; Tolerance: 10%
C101-C103 C105 = CAP-100N-0001: as C205 on sheet Buck; Manufacturer Part Number: CC0603KRX7R0BB104; Temperature Coefficient: X7R; Package Size: 0603
C104 C106 = CAP-1U-0002: 1 µF ±10% 50V Ceramic Capacitor X7R 0603 (1608 Metric); Package Size: 0603; Tolerance: 10%
C107 = CAP-10N-0001: 10000 pF ±10% 100V Ceramic Capacitor X7R 0402 (1005 Metric); Manufacturer: YAGEO; Assembled?: no; Manufacturer Part Number: CC0402KRX7R0BB103; Temperature Coefficient: X7R; Package Size: 0402; Tolerance: 10%
D100-D102 = LED_Amber_0001: as D400 on sheet DirCtl; Manufacturer Part Number: 150060AS75000; Package Size: 0603
R100 R101 = RES-4.7K-0002: RES SMD 4.7K OHM 1% 1/10W 0603; Manufacturer: YAGEO; Assembled?: no; Power: 0.1 W; Manufacturer Part Number: AF0603FR-074K7L; Package Size: 0603; Tolerance: 1%
R102-R104 = RES-100-0002: as R204 on sheet Buck; Manufacturer Part Number: AC0603FR-10100RL; Package Size: 0603; Tolerance: 1%
U100 = IC-STM32G431CBT6: ARM® Cortex®-M4F STM32G4 Microcontroller IC 32-Bit Single-Core 170MHz 128KB (128K x 8) FLASH 48-LQFP (7x7); Parameter 1: *

## Nets that join several sheets
BIAS: M0 (10 pins), M1 (10 pins), Power (C200.1 C210.1 U200.1 U201.1), Power/M0 (15 pins), Power/M1 (15 pins)
CAN_VCC: Connectors (X3.P$4 X6.P$4), Power (C211.1 TP201.1 U201.3), CAN_Trcv (C300.1 C301.1 U300.3)
MCU_VBAT: Connectors (X9.P$1), M0 (C400_M0.1 C401_M0.2 I400_M0.8 I401_M0.8), M1 (C400_M1.1 C401_M1.2 I400_M1.8 I401_M1.8), Power (C201.1 TP200.1 U200.3), MCU (16 pins)
MCU_VSS: Connectors (18 pins), M0 (8 pins), M1 (8 pins), M0 (14 pins), M1 (14 pins), Power (10 pins), Power/M0 (36 pins), Power/M1 (36 pins), CAN_Trcv (5 pins), MCU (15 pins)
Vin: Connectors (X7.P$2), Power (D200.1 R200.2 R202.2 TP202.1), Power/M0 (11 pins), Power/M1 (11 pins)
`: M0 (I400_M0.6 I401_M0.6), MCU (U100.27)
`: M1 (I400_M1.6 I401_M1.6), MCU (U100.26)
CAN_N: Connectors (X8.P$3 X10.P$3), CAN_Trcv (R300.1 U300.6)
CAN_P: Connectors (X8.P$1 X10.P$1), CAN_Trcv (R300.2 U300.7)
CAN_STB: CAN_Trcv (R301.1 U300.8), MCU (U100.32)
DIR_1_In: M0 (I401_M0.5 R401_M0.1), M0 (I402_M0.5 I403_M0.6)
DIR_1_In: M1 (I401_M1.5 R401_M1.1), M1 (I402_M1.5 I403_M1.6)
DIR_2_In: M0 (I400_M0.5 R400_M0.1), M0 (I402_M0.6 I403_M0.5)
DIR_2_In: M1 (I400_M1.5 R400_M1.1), M1 (I402_M1.6 I403_M1.5)
FDCAN_RX: CAN_Trcv (U300.4), MCU (U100.33)
FDCAN_TX: CAN_Trcv (U300.1), MCU (U100.34)
I2C1_SCL: Connectors (X9.P$5), MCU (R100.1 U100.39)
I2C1_SDA: Connectors (X9.P$2), MCU (R101.1 U100.46)
M0_PWM: M0 (I400_M0.1 I401_M0.2), MCU (U100.28)
M1_PWM: M1 (I400_M1.1 I401_M1.2), MCU (U100.25)
M+: Connectors (X2.P$1), M0 (7 pins)
M+: Connectors (X4.P$1), M1 (7 pins)
M-: Connectors (X2.P$2), M0 (7 pins)
M-: Connectors (X4.P$2), M1 (7 pins)
MOTOR_EN: Power (R202.1 R203.1), Power/M0 (LM200_M0.18), Power/M1 (LM200_M1.18)
NetQ200_2: Connectors (X7.P$1), Power (Q200.2)
NetU100_2: Connectors (X1.P$5), MCU (U100.2)
NetU100_3: Connectors (X1.P$6), MCU (U100.3)
NetU100_4: Connectors (X1.P$7), MCU (U100.4)
NetU100_5: Connectors (X1.P$8), MCU (U100.5)
NetU100_15: Connectors (X5.P$5), MCU (U100.15)
NetU100_16: Connectors (X5.P$6), MCU (U100.16)
NetU100_17: Connectors (X5.P$7), MCU (U100.17)
NetU100_18: Connectors (X5.P$8), MCU (U100.18)
QUAD_0_A: Connectors (X3.P$1), MCU (U100.43)
QUAD_0_B: Connectors (X3.P$3), MCU (U100.44)
QUAD_1_A: Connectors (X6.P$1), MCU (U100.14)
QUAD_1_B: Connectors (X6.P$3), MCU (U100.12)
SWCLK: Connectors (P1.1), MCU (U100.38)
SWDIO: Connectors (P1.2), MCU (U100.37)